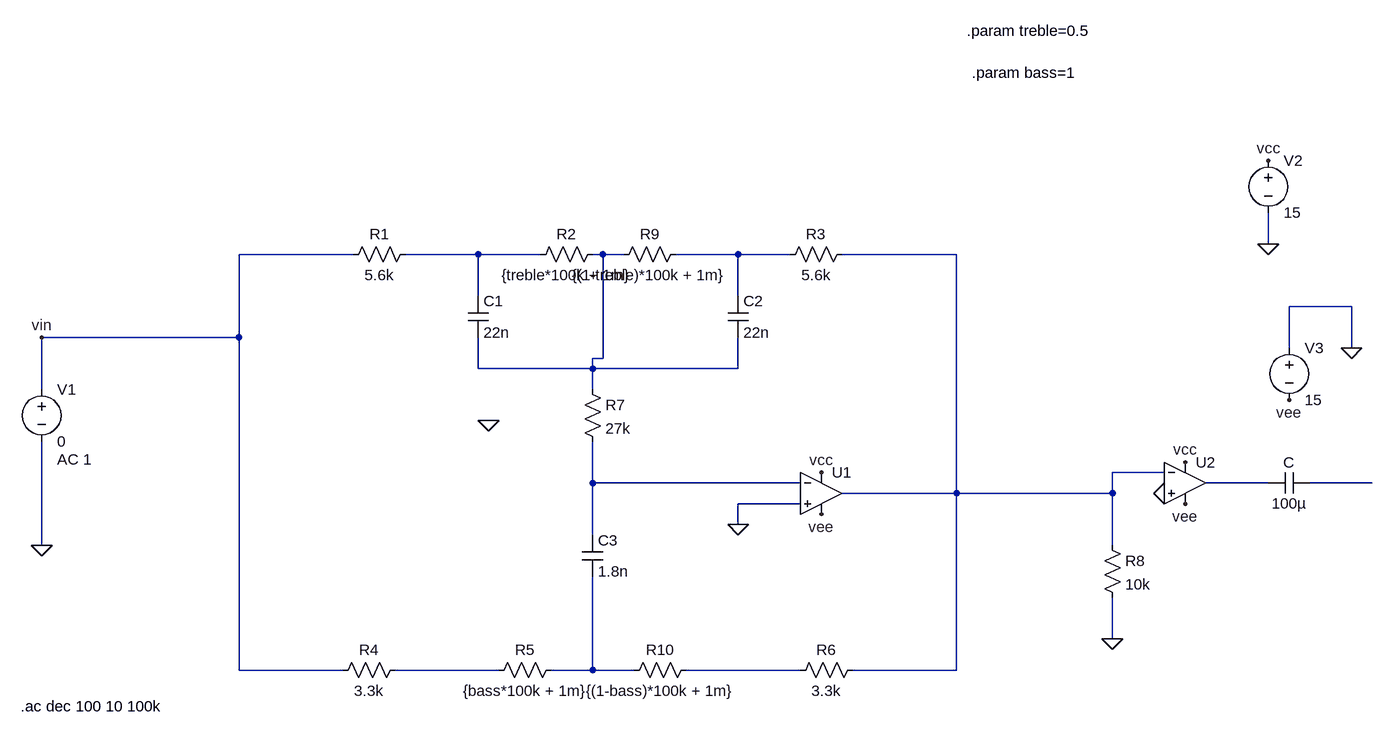
[diagram p0: schematic asd mini proj circuit simulation.asc]
asd mini proj circuit simulation.asc, the LTspice schematic file:
Version 4.1
SHEET 1 1364 680
WIRE 1200 -272 1200 -320
WIRE -208 -256 -384 -256
WIRE -16 -256 -128 -256
WIRE 80 -256 -16 -256
WIRE 176 -256 160 -256
WIRE 208 -256 176 -256
WIRE 384 -256 288 -256
WIRE 464 -256 384 -256
WIRE 720 -256 544 -256
WIRE -16 -192 -16 -256
WIRE 384 -192 384 -256
WIRE 1328 -176 1232 -176
WIRE -384 -128 -384 -256
WIRE -384 -128 -688 -128
WIRE 1232 -112 1232 -176
WIRE 1328 -112 1328 -176
WIRE 176 -96 176 -256
WIRE 176 -96 160 -96
WIRE -16 -80 -16 -128
WIRE 160 -80 160 -96
WIRE 160 -80 -16 -80
WIRE 384 -80 384 -128
WIRE 384 -80 160 -80
WIRE -688 -48 -688 -128
WIRE 160 -48 160 -80
WIRE 1040 80 960 80
WIRE 160 96 160 32
WIRE 480 96 160 96
WIRE 1200 96 1104 96
WIRE 1360 96 1264 96
WIRE 720 112 720 -256
WIRE 720 112 544 112
WIRE 960 112 960 80
WIRE 960 112 720 112
WIRE 480 128 384 128
WIRE 384 160 384 128
WIRE 160 176 160 96
WIRE -688 192 -688 32
WIRE 960 192 960 112
WIRE 960 336 960 272
WIRE -384 384 -384 -128
WIRE -224 384 -384 384
WIRE 16 384 -144 384
WIRE 160 384 160 240
WIRE 160 384 96 384
WIRE 224 384 160 384
WIRE 480 384 304 384
WIRE 720 384 720 112
WIRE 720 384 560 384
FLAG 384 160 0
FLAG -688 192 0
FLAG 1200 -272 0
FLAG 1200 -400 vcc
FLAG 1328 -112 0
FLAG 1232 -32 vee
FLAG 512 80 vcc
FLAG 512 144 vee
FLAG 960 336 0
FLAG -688 -128 vin
FLAG 1072 64 vcc
FLAG 1072 128 vee
FLAG 1040 112 0
FLAG 0 0 0
SYMBOL OpAmps\\UniversalOpAmp2 512 112 R0
SYMATTR InstName U1
SYMATTR Value2 Avol=1e6 GBW=10Meg Slew=10Meg
SYMBOL res -112 -272 R90
WINDOW 0 0 56 VBottom 2
WINDOW 3 32 56 VTop 2
SYMATTR InstName R1
SYMATTR Value 5.6k
SYMBOL res 560 -272 R90
WINDOW 0 0 56 VBottom 2
WINDOW 3 32 56 VTop 2
SYMATTR InstName R3
SYMATTR Value 5.6k
SYMBOL res -128 368 R90
WINDOW 0 0 56 VBottom 2
WINDOW 3 32 56 VTop 2
SYMATTR InstName R4
SYMATTR Value 3.3k
SYMBOL res 576 368 R90
WINDOW 0 0 56 VBottom 2
WINDOW 3 32 56 VTop 2
SYMATTR InstName R6
SYMATTR Value 3.3k
SYMBOL cap -32 -192 R0
SYMATTR InstName C1
SYMATTR Value 22n
SYMBOL cap 368 -192 R0
SYMATTR InstName C2
SYMATTR Value 22n
SYMBOL res 144 -64 R0
SYMATTR InstName R7
SYMATTR Value 27k
SYMBOL cap 144 176 R0
SYMATTR InstName C3
SYMATTR Value 1.8n
SYMBOL voltage -688 -64 R0
WINDOW 123 24 124 Left 2
WINDOW 39 0 0 Left 0
SYMATTR Value2 AC 1
SYMATTR InstName V1
SYMATTR Value 0
SYMBOL voltage 1200 -416 R0
WINDOW 123 0 0 Left 0
WINDOW 39 0 0 Left 0
SYMATTR InstName V2
SYMATTR Value 15
SYMBOL voltage 1232 -128 R0
WINDOW 123 0 0 Left 0
WINDOW 39 0 0 Left 0
SYMATTR InstName V3
SYMATTR Value 15
SYMBOL res 944 176 R0
SYMATTR InstName R8
SYMATTR Value 10k
SYMBOL res 176 -272 R90
WINDOW 0 0 56 VBottom 2
WINDOW 3 32 56 VTop 2
SYMATTR InstName R2
SYMATTR Value {treble*100k + 1m}
SYMBOL res 304 -272 R90
WINDOW 0 0 56 VBottom 2
WINDOW 3 32 56 VTop 2
SYMATTR InstName R9
SYMATTR Value {(1-treble)*100k + 1m}
SYMBOL res 112 368 R90
WINDOW 0 0 56 VBottom 2
WINDOW 3 32 56 VTop 2
SYMATTR InstName R5
SYMATTR Value {bass*100k + 1m}
SYMBOL res 320 368 R90
WINDOW 0 0 56 VBottom 2
WINDOW 3 32 56 VTop 2
SYMATTR InstName R10
SYMATTR Value {(1-bass)*100k + 1m}
SYMBOL OpAmps\\UniversalOpAmp2 1072 96 R0
SYMATTR InstName U2
SYMBOL cap 1264 80 R90
WINDOW 0 0 32 VBottom 2
WINDOW 3 32 32 VTop 2
SYMATTR InstName C
SYMATTR Value 100µ
TEXT 736 -600 Left 2 !.param treble=0.5
TEXT 744 -536 Left 2 !.param bass=1
TEXT -720 440 Left 2 !.ac dec 100 10 100k

The netlist it stands for:
* asd mini proj circuit simulation.asc
X§U1 0 N005 vcc vee N004 level2 Avol=1e6 GBW=10Meg Slew=10Meg Ilimit=25m Rail=0 Vos=0 En=0 Enk=0 In=0 Ink=0 Rin=500Meg  ; pins In+ In- V+ V- OUT
R1 N001 vin 5.6k
R3 N004 N003 5.6k
R4 N008 vin 3.3k
R6 N004 N010 3.3k
C1 N001 N002 22n
C2 N003 N002 22n
R7 N002 N005 27k
C3 N005 N009 1.8n
V1 vin 0 0 AC 1
V2 vcc 0 15
V3 0 vee 15
R8 N004 0 10k
R2 N002 N001 {treble*100k + 1m}
R9 N003 N002 {(1-treble)*100k + 1m}
R5 N009 N008 {bass*100k + 1m}
R10 N010 N009 {(1-bass)*100k + 1m}
X§U2 0 N004 vcc vee N006 level2 Avol=1Meg GBW=10Meg Slew=10Meg Ilimit=25m Rail=0 Vos=0 En=0 Enk=0 In=0 Ink=0 Rin=500Meg  ; pins In+ In- V+ V- OUT
C N007 N006 100µ
.param treble=0.5
.param bass=1
.ac dec 100 10 100k
.lib UniversalOpAmp2.lib
.backanno
.end